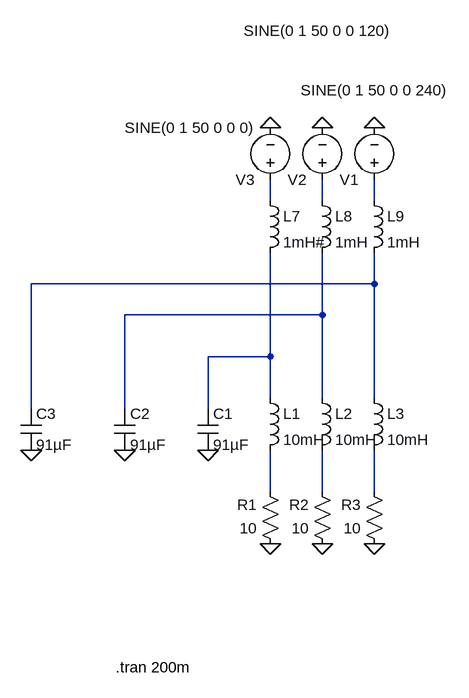
[diagram p0: schematic dqoabc3.asc]
dqoabc3.asc, the LTspice schematic file:
Version 4
SHEET 1 3872 1864
WIRE 976 -16 976 -48
WIRE 1056 -16 1056 -48
WIRE 1136 -16 1136 -48
WIRE 1136 112 1136 64
WIRE 1136 112 608 112
WIRE 1056 160 1056 64
WIRE 1056 160 752 160
WIRE 976 224 976 64
WIRE 976 224 880 224
WIRE 976 288 976 224
WIRE 1056 288 1056 160
WIRE 1136 288 1136 112
WIRE 608 304 608 112
WIRE 752 304 752 160
WIRE 880 304 880 224
WIRE 976 432 976 368
WIRE 1056 432 1056 368
WIRE 1136 432 1136 368
FLAG 1136 -128 0
FLAG 1056 -128 0
FLAG 976 -128 0
FLAG 1136 512 0
FLAG 1056 512 0
FLAG 976 512 0
FLAG 880 368 0
FLAG 752 368 0
FLAG 608 368 0
SYMBOL voltage 1136 -32 R180
WINDOW 3 -114 154 Left 2
WINDOW 123 0 0 Left 0
WINDOW 39 0 0 Left 0
SYMATTR Value SINE(0 1 50 0 0 240)
SYMATTR InstName V1
SYMBOL voltage 1056 -32 R180
WINDOW 3 -106 245 Left 2
WINDOW 123 0 0 Left 0
WINDOW 39 0 0 Left 0
SYMATTR Value SINE(0 1 50 0 0 120)
SYMATTR InstName V2
SYMBOL voltage 976 -32 R180
WINDOW 123 0 0 Left 0
WINDOW 39 0 0 Left 0
SYMATTR InstName V3
SYMATTR Value SINE(0 1 50 0 0 0)
SYMBOL res 1152 528 R180
WINDOW 0 36 76 Left 2
WINDOW 3 36 40 Left 2
SYMATTR InstName R3
SYMATTR Value 10
SYMBOL res 1072 528 R180
WINDOW 0 36 76 Left 2
WINDOW 3 36 40 Left 2
SYMATTR InstName R2
SYMATTR Value 10
SYMBOL res 992 528 R180
WINDOW 0 36 76 Left 2
WINDOW 3 36 40 Left 2
SYMATTR InstName R1
SYMATTR Value 10
SYMBOL ind 960 272 R0
SYMATTR InstName L1
SYMATTR Value 10mH
SYMBOL ind 1040 272 R0
SYMATTR InstName L2
SYMATTR Value 10mH
SYMBOL ind 1120 272 R0
SYMATTR InstName L3
SYMATTR Value 10mH
SYMBOL ind 960 -32 R0
SYMATTR InstName L7
SYMATTR Value 1mH#
SYMBOL ind 1040 -32 R0
SYMATTR InstName L8
SYMATTR Value 1mH
SYMBOL ind 1120 -32 R0
SYMATTR InstName L9
SYMATTR Value 1mH
SYMBOL cap 864 304 R0
SYMATTR InstName C1
SYMATTR Value 91µF
SYMBOL cap 736 304 R0
SYMATTR InstName C2
SYMATTR Value 91µF
SYMBOL cap 592 304 R0
SYMATTR InstName C3
SYMATTR Value 91µF
TEXT 738 702 Left 2 !.tran 200m

The netlist it stands for:
* dqoabc3.asc
V1 N003 0 SINE(0 1 50 0 0 240)
V2 N002 0 SINE(0 1 50 0 0 120)
V3 N001 0 SINE(0 1 50 0 0 0)
R3 0 N009 10
R2 0 N008 10
R1 0 N007 10
L1 N006 N007 10mH
L2 N005 N008 10mH
L3 N004 N009 10mH
L7 N001 N006 1mH#
L8 N002 N005 1mH
L9 N003 N004 1mH
C1 N006 0 91µF
C2 N005 0 91µF
C3 N004 0 91µF
.tran 200m
.backanno
.end